# EAGLE schematic termopar (EAGLE 6.1)
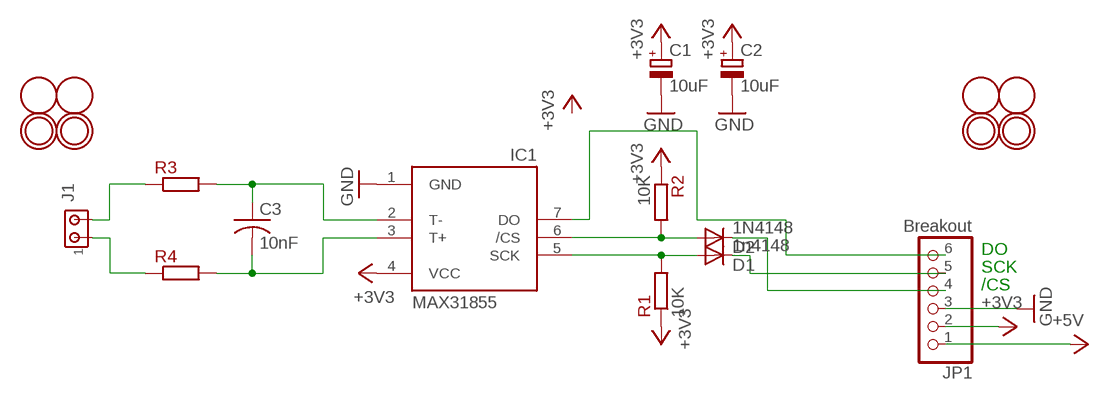
[diagram p0: schematic, sheet 1]

## Parts
C1  10uF  CPOL-EUE3.5-8  [E3,5-8]
C2  10uF  CPOL-EUE3.5-8  [E3,5-8]
C3  10nF  C-US050-030X075  [C050-030X075]
D1  1n4148  1N4148DO35-7  [DO35-7]
D2  1N4148  1N4148DO35-7  [DO35-7]
IC1  MAX31855  MAX6675  [SO08]
J1  MTA02-156  [1X2MTA]
JP1  Breakout  HEADER-1X676MIL  [1X06_ROUND_76]
R1  10K  R-EU_0207/10  [0207/10]
R2  10K  R-EU_0207/10  [0207/10]
R3  R-EU_0204/5  [0204/5]
R4  R-EU_0204/5  [0204/5]
U$1  FIDUCIAL  [FIDUCIAL_1MM]
U$2  FIDUCIAL  [FIDUCIAL_1MM]
U$3  FIDUCIAL  [FIDUCIAL_1MM]
U$4  MOUNTINGHOLE2.0  [MOUNTINGHOLE_2.0_PLATED]
U$5  MOUNTINGHOLE2.0  [MOUNTINGHOLE_2.0_PLATED]
U$6  FIDUCIAL  [FIDUCIAL_1MM]
U$7  MOUNTINGHOLE2.0  [MOUNTINGHOLE_2.0_PLATED]
U$8  MOUNTINGHOLE2.0  [MOUNTINGHOLE_2.0_PLATED]

## Nets
+3V3: C1.+ C2.+ IC1.4(VCC) JP1.2 R1.1 R2.1
+5V: JP1.1
CS: D2.A IC1.6(/CS) R2.2
DO: IC1.7(DO) JP1.6
GND: C1.- C2.- IC1.1(GND) JP1.3
N$1: J1.2 R3.1
N$2: D2.C JP1.4
N$3: D1.C JP1.5
N$4: C3.1 IC1.2(T-) R3.2
N$5: J1.1 R4.1
N$6: C3.2 IC1.3(T+) R4.2
SCK: D1.A IC1.5(SCK) R1.2

## Notes on the sheet
- DO
- SCK
- /CS

## Library data of the parts
C1 C2 = rcl:CPOL-EU: POLARIZED CAPACITOR, European symbol
C3 = rcl:C-US: CAPACITOR, American symbol
D1 D2 = diode:1N4148: DIODE high speed (Philips)
IC1 = adafruit:MAX6675
J1 = con-amp:MTA02-156: AMP connector
JP1 = microbuilder:HEADER-1X6: PIN HEADER
R1-R4 = rcl:R-EU_: RESISTOR, European symbol
U$1-U$3 U$6 = adafruit:FIDUCIAL: For use by pick and place machines to calibrate the vision/machine, 1mm By microbuilder.eu
U$4 U$5 U$7 U$8 = microbuilder:MOUNTINGHOLE: Mounting Hole